# Altium schematic sheet OneWireBus_Interface.SchDoc
size A4
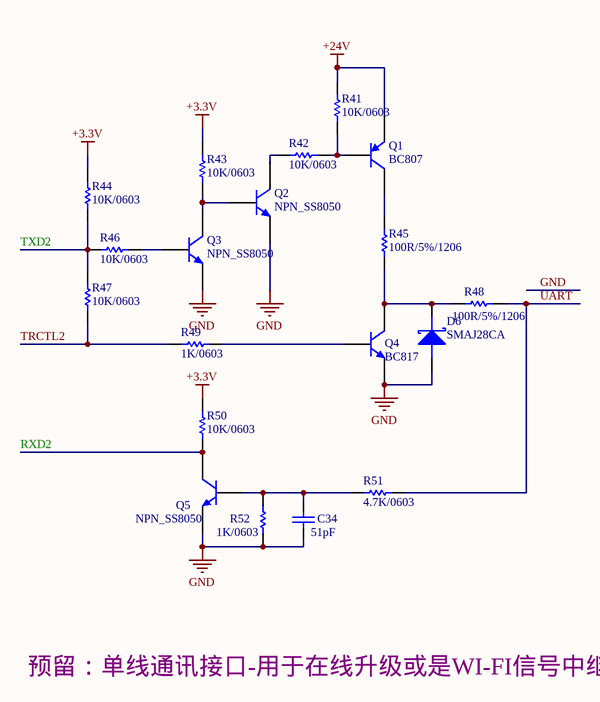
[diagram p0: OneWireBus_Interface.SchDoc]

## Parts
C34  51pF  [CAP/SMT/0603C]
D6  SMAJ28CA  [D/SMT/SMBJ4.0A]
Q1  BC807  [BJT/SMT/SOT-23]
Q2  NPN_SS8050  [BJT/SMT/SOT-23]
Q3  NPN_SS8050  [BJT/SMT/SOT-23]
Q4  BC817  [BJT/SMT/SOT-23]
Q5  NPN_SS8050  [BJT/SMT/SOT-23]
R41  10K/0603  [0603R]
R42  10K/0603  [0603R]
R43  10K/0603  [0603R]
R44  10K/0603  [0603R]
R45  100R/5%/1206  [1206R]
R46  10K/0603  [0603R]
R47  10K/0603  [0603R]
R48  100R/5%/1206  [1206R]
R49  1K/0603  [0603R]
R50  10K/0603  [0603R]
R51  4.7K/0603  [0603R]
R52  1K/0603  [0603R]

## Nets
+3.3V: R43.2 R44.1 R50.2
+24V: Q1.2(E) R41.2
GND: C34.1 D6.1(K) Q2.2(E) Q3.2(E) Q4.2(E) Q5.2(E) R52.2
RXD2: Q5.3(C) R50.1
TRCTL2: R47.2 R49.2
TXD2: R44.2 R46.2 R47.1
UART: R48.1 R51.2
NetC34_2: C34.2 Q5.1(B) R51.1 R52.1
NetD6_2: D6.2(A) Q4.3(C) R45.1 R48.2
NetQ1_1: Q1.1(B) R41.1 R42.1
NetQ1_3: Q1.3(C) R45.2
NetQ2_1: Q2.1(B) Q3.3(C) R43.1
NetQ2_3: Q2.3(C) R42.2
NetQ3_1: Q3.1(B) R46.1
NetQ4_1: Q4.1(B) R49.1

## Notes on the sheet
- Labels drawn without touching a wire or pin: 预留：单线通讯接口-用于在线升级或是WI-FI信号中继

## Library data of the parts
C34 = A_Cap_0805: Manufacturer: Generic Components; Class: Passive; SubClass: Capacitor; Value: 100pF; Published: 08/06/2000; Publisher: Altium Hobart Technology Centre
D6 = D/TVS/SMT/SMBJ6.5A/DO-214
Q1 = PNP: PNP Bipolar Transistor; Published: 8-Jun-2000; LatestRevisionDate: 29-May-2009; LatestRevisionNote: IPC-7351 Footprint Added.; PackageVersion: Aug-1999; PackageReference: SOT-23B; Publisher: Altium Limited; PackageDescription: 3-Pin SOT-23 Package 0.95 mm Pitch, 2.4 mm Lead Span
Q2-Q5 = BJT/NPN/SMT/SS8050/SOT-23: Vce25V/Vcb40V/Veb5V/Ic1.5V/Pd300mW; Published: *; Publisher: *; Manufacturer: *; Class: *; SubClass: *
R41-R44 R46 R47 R49-R52 = A_Res_0805: Resistor; Manufacturer: Generic Components; Class: Passive; Value: 1K; Published: 08/06/2000; Publisher: Altium Hobart Technology Centre; SubClass: Resistor
R45 R48 = RES/RES/SMT/1206